# Altium schematic sheet I2C_MULTIPLEX.SchDoc: My title
size A3; Organization: University of California; Address1: 475 Portola Plaza; Address2: Los Angeles, CA 90095; Revision: R01; SheetNumber: 1; SheetTotal: 1
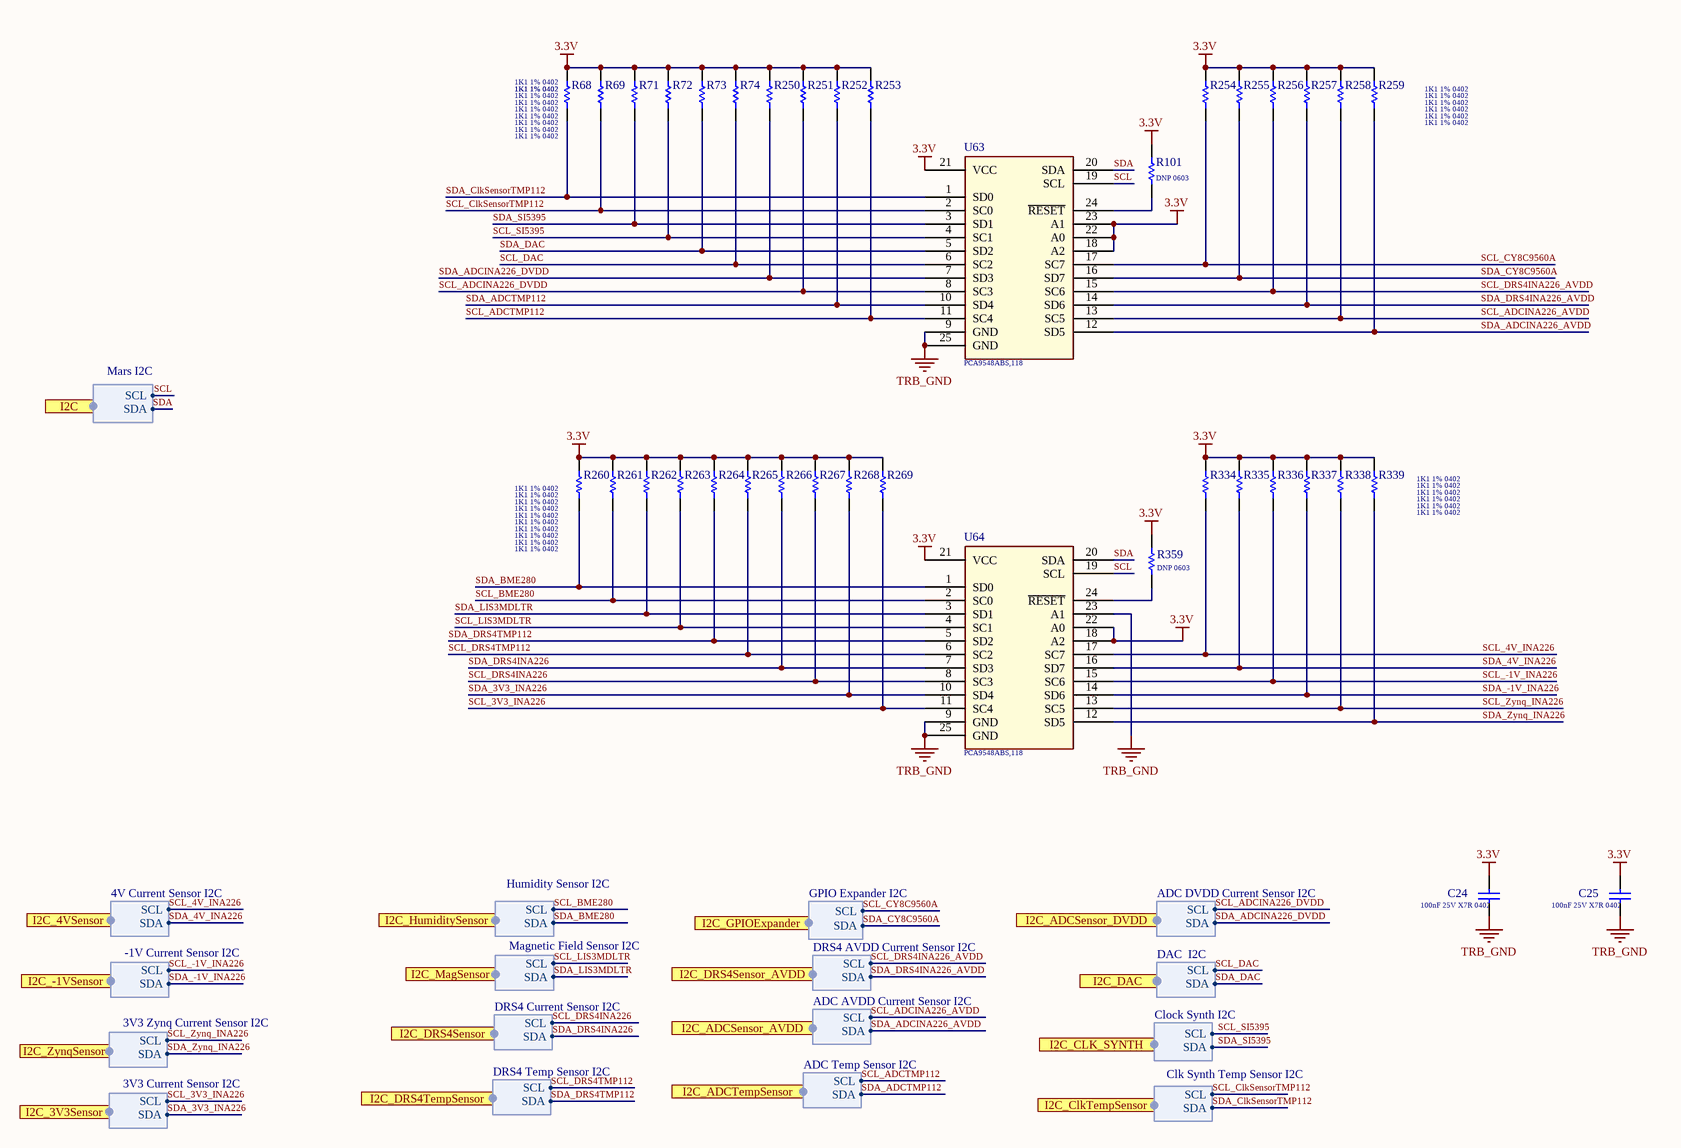
[diagram p0: I2C_MULTIPLEX.SchDoc]

## Parts
C24  Capacitance: 100nF 25V X7R 0402  [Cap_Taiyo_Yuden_TMK105B7104KV-FR_100nF]  (hidden comment: Cap_Taiyo_Yuden_TMK105B7104KV-FR_100nF)
C25  Capacitance: 100nF 25V X7R 0402  [Cap_Taiyo_Yuden_TMK105B7104KV-FR_100nF]  (hidden comment: Cap_Taiyo_Yuden_TMK105B7104KV-FR_100nF)
R68  1K1 1% 0402  [RESC0402(1005)_L]
R69  1K1 1% 0402  [RESC0402(1005)_L]
R71  1K1 1% 0402  [RESC0402(1005)_L]
R72  1K1 1% 0402  [RESC0402(1005)_L]
R73  1K1 1% 0402  [RESC0402(1005)_L]
R74  1K1 1% 0402  [RESC0402(1005)_L]
R101  Resistance: DNP 0603  [RES_DNP_0603]  (hidden comment: RES_DNP_0603)
R250  1K1 1% 0402  [RESC0402(1005)_L]
R251  1K1 1% 0402  [RESC0402(1005)_L]
R252  1K1 1% 0402  [RESC0402(1005)_L]
R253  1K1 1% 0402  [RESC0402(1005)_L]
R254  1K1 1% 0402  [RESC0402(1005)_L]
R255  1K1 1% 0402  [RESC0402(1005)_L]
R256  1K1 1% 0402  [RESC0402(1005)_L]
R257  1K1 1% 0402  [RESC0402(1005)_L]
R258  1K1 1% 0402  [RESC0402(1005)_L]
R259  1K1 1% 0402  [RESC0402(1005)_L]
R260  1K1 1% 0402  [RESC0402(1005)_L]
R261  1K1 1% 0402  [RESC0402(1005)_L]
R262  1K1 1% 0402  [RESC0402(1005)_L]
R263  1K1 1% 0402  [RESC0402(1005)_L]
R264  1K1 1% 0402  [RESC0402(1005)_L]
R265  1K1 1% 0402  [RESC0402(1005)_L]
R266  1K1 1% 0402  [RESC0402(1005)_L]
R267  1K1 1% 0402  [RESC0402(1005)_L]
R268  1K1 1% 0402  [RESC0402(1005)_L]
R269  1K1 1% 0402  [RESC0402(1005)_L]
R334  1K1 1% 0402  [RESC0402(1005)_L]
R335  1K1 1% 0402  [RESC0402(1005)_L]
R336  1K1 1% 0402  [RESC0402(1005)_L]
R337  1K1 1% 0402  [RESC0402(1005)_L]
R338  1K1 1% 0402  [RESC0402(1005)_L]
R339  1K1 1% 0402  [RESC0402(1005)_L]
R359  Resistance: DNP 0603  [RES_DNP_0603]  (hidden comment: RES_DNP_0603)
U63  Series: PCA9548ABS,118  [IC_NXP_PCA9548ABS,118_I2C_8Channel]  (hidden comment: IC_NXP_PCA9548ABS,118_I2C_8Channel)
U64  Series: PCA9548ABS,118  [IC_NXP_PCA9548ABS,118_I2C_8Channel]  (hidden comment: IC_NXP_PCA9548ABS,118_I2C_8Channel)

## Ports
I2C (harness Mars I2C), I2C_3V3Sensor (harness 3V3 Current Sensor I2C), I2C_4VSensor (harness 4V Current Sensor I2C), I2C_-1VSensor (harness -1V Current Sensor I2C), I2C_ADCSensor_AVDD (harness ADC AVDD Current Sensor I2C), I2C_ADCSensor_DVDD (harness ADC DVDD Current Sensor I2C), I2C_ADCTempSensor (harness ADC Temp Sensor I2C), I2C_CLK_SYNTH (harness Clock Synth I2C), I2C_ClkTempSensor (harness Clk Synth Temp Sensor I2C), I2C_DAC (harness DAC  I2C), I2C_DRS4Sensor (harness DRS4 Current Sensor I2C), I2C_DRS4Sensor_AVDD (harness DRS4 AVDD Current Sensor I2C), I2C_DRS4TempSensor (harness DRS4 Temp Sensor I2C), I2C_GPIOExpander (harness GPIO Expander I2C), I2C_HumiditySensor (harness Humidity Sensor I2C), I2C_MagSensor (harness Magnetic Field Sensor I2C), I2C_ZynqSensor (harness 3V3 Zynq Current Sensor I2C)

## Harnesses
Mars I2C: SCL, SDA
4V Current Sensor I2C: SCL, SDA
-1V Current Sensor I2C: SCL, SDA
3V3 Zynq Current Sensor I2C: SCL, SDA
3V3 Current Sensor I2C: SCL, SDA
Humidity Sensor I2C: SCL, SDA
Magnetic Field Sensor I2C: SCL, SDA
DRS4 Temp Sensor I2C: SCL, SDA
DRS4 Current Sensor I2C: SCL, SDA
DRS4 AVDD Current Sensor I2C: SCL, SDA
GPIO Expander I2C: SCL, SDA
ADC AVDD Current Sensor I2C: SCL, SDA
ADC Temp Sensor I2C: SCL, SDA
ADC DVDD Current Sensor I2C: SCL, SDA
DAC  I2C: SCL, SDA
Clock Synth I2C: SCL, SDA
Clk Synth Temp Sensor I2C: SCL, SDA

## Nets
3.3V: C24.2 C25.2 R68.2 R69.2 R71.2 R72.2 R73.2 R74.2 R101.1 R250.2 R251.2 R252.2 R253.2 R254.2 R255.2 R256.2 R257.2 R258.2 R259.2 R260.2 R261.2 R262.2 R263.2 R264.2 R265.2 R266.2 R267.2 R268.2 R269.2 R334.2 R335.2 R336.2 R337.2 R338.2 R339.2 R359.1 U63.18(A2) U63.21(VCC) U63.22(A0) U63.23(A1) U64.18(A2) U64.21(VCC) U64.22(A0)
TRB_GND: C24.1 C25.1 U63.9(GND) U63.25(GND) U64.9(GND) U64.23(A1) U64.25(GND)
SCL: U63.19(SCL) U64.19(SCL) ; port I2C.SCL
SCL_3V3_INA226: R269.1 U64.11(SC4) ; port I2C_3V3Sensor.SCL
SCL_4V_INA226: R334.1 U64.17(SC7) ; port I2C_4VSensor.SCL
SCL_-1V_INA226: R336.1 U64.15(SC6) ; port I2C_-1VSensor.SCL
SCL_ADCINA226_AVDD: R258.1 U63.13(SC5) ; port I2C_ADCSensor_AVDD.SCL
SCL_ADCINA226_DVDD: R251.1 U63.8(SC3) ; port I2C_ADCSensor_DVDD.SCL
SCL_ADCTMP112: R253.1 U63.11(SC4) ; port I2C_ADCTempSensor.SCL
SCL_BME280: R261.1 U64.2(SC0) ; port I2C_HumiditySensor.SCL
SCL_ClkSensorTMP112: R69.1 U63.2(SC0) ; port I2C_ClkTempSensor.SCL
SCL_CY8C9560A: R254.1 U63.17(SC7) ; port I2C_GPIOExpander.SCL
SCL_DAC: R74.1 U63.6(SC2) ; port I2C_DAC.SCL
SCL_DRS4INA226: R267.1 U64.8(SC3) ; port I2C_DRS4Sensor.SCL
SCL_DRS4INA226_AVDD: R256.1 U63.15(SC6) ; port I2C_DRS4Sensor_AVDD.SCL
SCL_DRS4TMP112: R265.1 U64.6(SC2) ; port I2C_DRS4TempSensor.SCL
SCL_LIS3MDLTR: R263.1 U64.4(SC1) ; port I2C_MagSensor.SCL
SCL_SI5395: R72.1 U63.4(SC1) ; port I2C_CLK_SYNTH.SCL
SCL_Zynq_INA226: R338.1 U64.13(SC5) ; port I2C_ZynqSensor.SCL
SDA: U63.20(SDA) U64.20(SDA) ; port I2C.SDA
SDA_3V3_INA226: R268.1 U64.10(SD4) ; port I2C_3V3Sensor.SDA
SDA_4V_INA226: R335.1 U64.16(SD7) ; port I2C_4VSensor.SDA
SDA_-1V_INA226: R337.1 U64.14(SD6) ; port I2C_-1VSensor.SDA
SDA_ADCINA226_AVDD: R259.1 U63.12(SD5) ; port I2C_ADCSensor_AVDD.SDA
SDA_ADCINA226_DVDD: R250.1 U63.7(SD3) ; port I2C_ADCSensor_DVDD.SDA
SDA_ADCTMP112: R252.1 U63.10(SD4) ; port I2C_ADCTempSensor.SDA
SDA_BME280: R260.1 U64.1(SD0) ; port I2C_HumiditySensor.SDA
SDA_ClkSensorTMP112: R68.1 U63.1(SD0) ; port I2C_ClkTempSensor.SDA
SDA_CY8C9560A: R255.1 U63.16(SD7) ; port I2C_GPIOExpander.SDA
SDA_DAC: R73.1 U63.5(SD2) ; port I2C_DAC.SDA
SDA_DRS4INA226: R266.1 U64.7(SD3) ; port I2C_DRS4Sensor.SDA
SDA_DRS4INA226_AVDD: R257.1 U63.14(SD6) ; port I2C_DRS4Sensor_AVDD.SDA
SDA_DRS4TMP112: R264.1 U64.5(SD2) ; port I2C_DRS4TempSensor.SDA
SDA_LIS3MDLTR: R262.1 U64.3(SD1) ; port I2C_MagSensor.SDA
SDA_SI5395: R71.1 U63.3(SD1) ; port I2C_CLK_SYNTH.SDA
SDA_Zynq_INA226: R339.1 U64.12(SD5) ; port I2C_ZynqSensor.SDA
NetR101_2: R101.2 U63.24(~{RESET})
NetR359_2: R359.2 U64.24(~{RESET})

## Notes on the sheet
- 475 Portola Plaza
- GAPS TOF
- igarcia91@g.ucla.edu
- Los Angeles, CA
- 310-825-0344
- Size:
- Date:
- Letter
- Number:
- Time:
- Sheet
- Revision:
- of
- andrew.peck@cern.ch
- spq@ucla.edu
- File:

## Library data of the parts
C24 C25 = Cap_Taiyo_Yuden_TMK105B7104KV-FR_100nF: CAP CER 100nF 25V X7R 0402; Supplier 1: Mouser; Supplier Part Number 1: 963-TMK105B7104KV-FR
R68 R69 R71-R74 R250-R269 R334-R339 = CMP-1011-00514-1: 1K1 0.063W 1% 0402 (1005 Metric)  SMD; Case-Metric: 1005; Case-EIA: 0402; Value: 1100.00 Ohm; Power: 0.063 W; Tolerance: 1 %; Technology: SMT
R101 R359 = RES_DNP_0603: 0603 Do not place resistor
U63 U64 = IC_NXP_PCA9548ABS,118_I2C_8Channel: Multiplexer Switch ICs 8CH I2C SWTCH W/REST; Supplier Part Number 1: 771-PCA9548ABS118; Supplier 1: Mouser